# Altium schematic sheet 105358-3SC002-01-A_IR_extra.SchDoc: I/O Board
size 420 x 297 mm; DrawnBy: JeSa , KaKa; Organization: Hotswap Norden AB; Address1: Knarrarnäsgatan 7; Address2: SE-164 40 Kista; Address3: Sweden; DocumentNumber: 105358-3SC001-01; SheetNumber: 5; SheetTotal: 5; PageSetup: Record=PageOptions|CenterHorizontal=True|CenterVertical=True|PrintScale=0.96|XCorrection=1.00|YCorrection=1.00|PrintKind=0|BorderSize=5000000|LeftOffset=0|BottomOffset=0|Orientation=2|PaperLength=1000|PaperWidth=1000|Scale=100|PaperSource=7|PrintQuality=-4|MediaType=1|DitherType=10|PaperKind=A3|PrintScaleMode=1
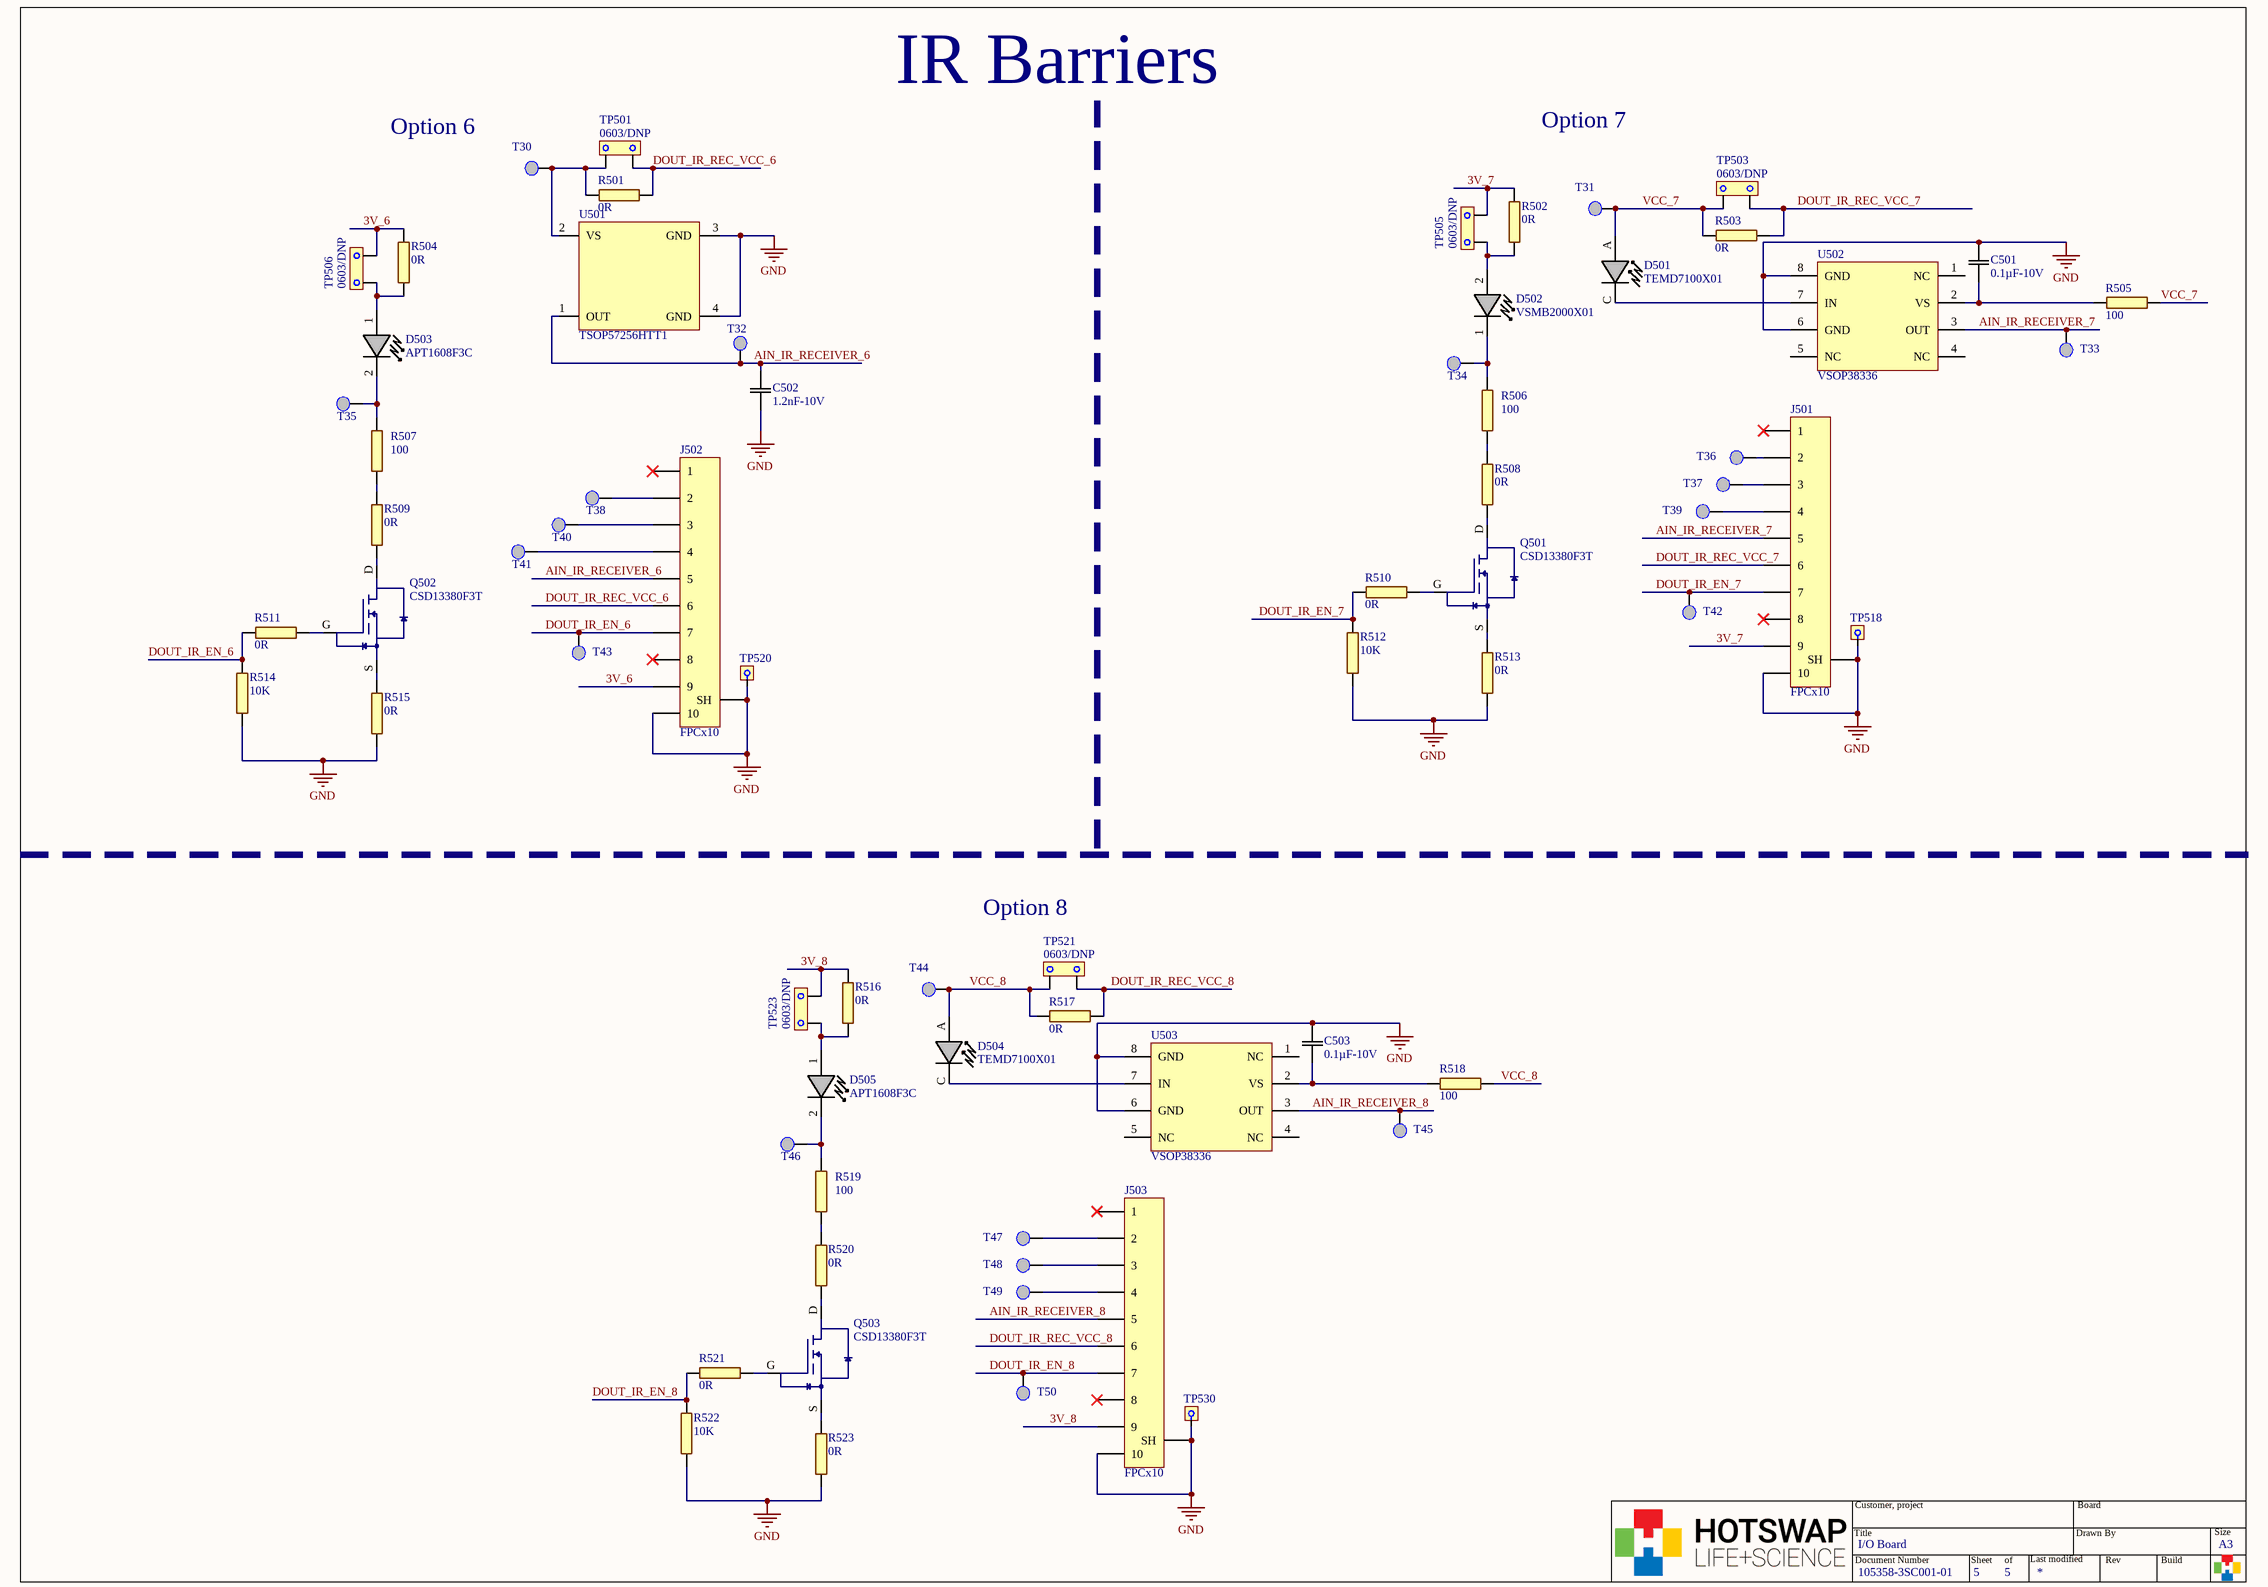
[diagram p0: 105358-3SC002-01-A_IR_extra.SchDoc]

## Parts
C501  0.1µF-10V  [0402C_HIGH_DENSITY]
C502  1.2nF-10V  [0402C_HIGH_DENSITY]
C503  0.1µF-10V  [0402C_HIGH_DENSITY]
D501  TEMD7100X01  [TEMD7100X01]
D502  VSMB2000X01  [SODFL580X160]
D503  APT1608F3C  [APT1608F3C]
D504  TEMD7100X01  [TEMD7100X01]
D505  APT1608F3C  [APT1608F3C]
J501  FPCx10  [FPCx10-5034801000]
J502  FPCx10  [FPCx10-5034801000]
J503  FPCx10  [FPCx10-5034801000]
Q501  CSD13380F3T  [CSD13380F3-DFN40P69X35-3L]
Q502  CSD13380F3T  [CSD13380F3-DFN40P69X35-3L]
Q503  CSD13380F3T  [CSD13380F3-DFN40P69X35-3L]
R501  0R  [0603R-GENRIC]
R502  0R  [0603R-GENRIC]
R503  0R  [0603R-GENRIC]
R504  0R  [0603R-GENRIC]
R505  100  [0402R-GENERIC]
R506  100  [0402R-GENERIC]
R507  100  [0402R-GENERIC]
R508  0R  [0603R-GENRIC]
R509  0R  [0603R-GENRIC]
R510  0R  [0603R-GENRIC]
R511  0R  [0603R-GENRIC]
R512  10K  [0402R-GENERIC]
R513  0R  [0603R-GENRIC]
R514  10K  [0402R-GENERIC]
R515  0R  [0603R-GENRIC]
R516  0R  [0603R-GENRIC]
R517  0R  [0603R-GENRIC]
R518  100  [0402R-GENERIC]
R519  100  [0402R-GENERIC]
R520  0R  [0603R-GENRIC]
R521  0R  [0603R-GENRIC]
R522  10K  [0402R-GENERIC]
R523  0R  [0603R-GENRIC]
T30  TEST POINT  [PAD TEST POINT]  (value not drawn)  (no BOM)
T31  TEST POINT  [PAD TEST POINT]  (value not drawn)  (no BOM)
T32  TEST POINT  [PAD TEST POINT]  (value not drawn)  (no BOM)
T33  TEST POINT  [PAD TEST POINT]  (value not drawn)  (no BOM)
T34  TEST POINT  [PAD TEST POINT]  (value not drawn)  (no BOM)
T35  TEST POINT  [PAD TEST POINT]  (value not drawn)  (no BOM)
T36  TEST POINT  [PAD TEST POINT]  (value not drawn)  (no BOM)
T37  TEST POINT  [PAD TEST POINT]  (value not drawn)  (no BOM)
T38  TEST POINT  [PAD TEST POINT]  (value not drawn)  (no BOM)
T39  TEST POINT  [PAD TEST POINT]  (value not drawn)  (no BOM)
T40  TEST POINT  [PAD TEST POINT]  (value not drawn)  (no BOM)
T41  TEST POINT  [PAD TEST POINT]  (value not drawn)  (no BOM)
T42  TEST POINT  [PAD TEST POINT]  (value not drawn)  (no BOM)
T43  TEST POINT  [PAD TEST POINT]  (value not drawn)  (no BOM)
T44  TEST POINT  [PAD TEST POINT]  (value not drawn)  (no BOM)
T45  TEST POINT  [PAD TEST POINT]  (value not drawn)  (no BOM)
T46  TEST POINT  [PAD TEST POINT]  (value not drawn)  (no BOM)
T47  TEST POINT  [PAD TEST POINT]  (value not drawn)  (no BOM)
T48  TEST POINT  [PAD TEST POINT]  (value not drawn)  (no BOM)
T49  TEST POINT  [PAD TEST POINT]  (value not drawn)  (no BOM)
T50  TEST POINT  [PAD TEST POINT]  (value not drawn)  (no BOM)
TP501  0603/DNP  [TESTPOINT_C_R0608]  (no BOM)
TP503  0603/DNP  [TESTPOINT_C_R0608]  (no BOM)
TP505  0603/DNP  [TESTPOINT_C_R0608]  (no BOM)
TP506  0603/DNP  [TESTPOINT_C_R0608]  (no BOM)
TP518  TP_V_HOOK  [Testpoint_Hook]  (value not drawn)  (no BOM)
TP520  TP_V_HOOK  [Testpoint_Hook]  (value not drawn)  (no BOM)
TP521  0603/DNP  [TESTPOINT_C_R0608]  (no BOM)
TP523  0603/DNP  [TESTPOINT_C_R0608]  (no BOM)
TP530  TP_V_HOOK  [Testpoint_Hook]  (value not drawn)  (no BOM)
U501  TSOP57256HTT1  [TSOP57256HTT1]
U502  VSOP38336  [VSOP38336]
U503  VSOP38336  [VSOP38336]

## Nets
GND: C501.2 C502.1 C503.2 J501.10 J501.SH J502.10 J502.SH J503.10 J503.SH R512.2 R513.1 R514.2 R515.1 R522.2 R523.1 TP518.1 TP520.1 TP530.1 U501.3(GND) U501.4(GND) U502.6(GND) U502.8(GND) U503.6(GND) U503.8(GND)
3V_6: J502.9 R504.2 TP506.2
3V_7: J501.9 R502.2 TP505.2
3V_8: J503.9 R516.2 TP523.2
AIN_IR_RECEIVER_6: C502.2 J502.5 T32.1(Test_Point) U501.1(OUT)
AIN_IR_RECEIVER_7: J501.5 T33.1(Test_Point) U502.3(OUT)
AIN_IR_RECEIVER_8: J503.5 T45.1(Test_Point) U503.3(OUT)
DOUT_IR_EN_6: J502.7 R511.1 R514.1 T43.1(Test_Point)
DOUT_IR_EN_7: J501.7 R510.1 R512.1 T42.1(Test_Point)
DOUT_IR_EN_8: J503.7 R521.1 R522.1 T50.1(Test_Point)
DOUT_IR_REC_VCC_6: J502.6 R501.2 TP501.2
DOUT_IR_REC_VCC_7: J501.6 R503.2 TP503.2
DOUT_IR_REC_VCC_8: J503.6 R517.2 TP521.2
VCC_7: D501.A R503.1 R505.2 T31.1(Test_Point) TP503.1
VCC_8: D504.A R517.1 R518.2 T44.1(Test_Point) TP521.1
NetC501_1: C501.1 R505.1 U502.2(VS)
NetC503_1: C503.1 R518.1 U503.2(VS)
NetD501_C: D501.C U502.7(IN)
NetD502_1: D502.1(C) R506.1 T34.1(Test_Point)
NetD502_2: D502.2(A) R502.1 TP505.1
NetD503_1: D503.1(A) R504.1 TP506.1
NetD503_2: D503.2(K) R507.1 T35.1(Test_Point)
NetD504_C: D504.C U503.7(IN)
NetD505_1: D505.1(A) R516.1 TP523.1
NetD505_2: D505.2(K) R519.1 T46.1(Test_Point)
NetJ501_2: J501.2 T36.1(Test_Point)
NetJ501_3: J501.3 T37.1(Test_Point)
NetJ501_4: J501.4 T39.1(Test_Point)
NetJ502_2: J502.2 T38.1(Test_Point)
NetJ502_3: J502.3 T40.1(Test_Point)
NetJ502_4: J502.4 T41.1(Test_Point)
NetJ503_2: J503.2 T47.1(Test_Point)
NetJ503_3: J503.3 T48.1(Test_Point)
NetJ503_4: J503.4 T49.1(Test_Point)
NetQ501_D: Q501.D R508.2
NetQ501_G: Q501.G R510.2
NetQ501_S: Q501.S R513.2
NetQ502_D: Q502.D R509.2
NetQ502_G: Q502.G R511.2
NetQ502_S: Q502.S R515.2
NetQ503_D: Q503.D R520.2
NetQ503_G: Q503.G R521.2
NetQ503_S: Q503.S R523.2
NetR501_1: R501.1 T30.1(Test_Point) TP501.1 U501.2(VS)
NetR506_2: R506.2 R508.1
NetR507_2: R507.2 R509.1
NetR519_2: R519.2 R520.1

Not connected (* = marked no-connect by the designer): J501 1* 8*; J502 1* 8*; J503 1* 8*; U502 1(NC) 4(NC) 5(NC); U503 1(NC) 4(NC) 5(NC)

## Notes on the sheet
- IR Barriers
- Option 7
- Option 6
- Option 8
- Title
- Customer, project
- Drawn By
- Board
- Size
- Document Number
- Sheet
- of
- Last modified
- Rev
- Build
- A3

## Library data of the parts
C501 C503 = 0402C-0.1uF-10V: 0.1µF ±10% 10V X5R Ceramic Capacitor 0402; Manufacturer Part Number: CC0402KRX5R6BB104; Manufacturer: Yageo; Capacitance: 0.1µF; Digi-Key Part Number: 311-1336-1-ND; PackageReference: 0402; Temperature Coefficient: X5R; Tolerance: 10%; Voltage - Rated: 10V
C502 = 0402C-1.2nF-10V: 1.2nF ±10% 10V U2J Ceramic Capacitor 0402; Manufacturer Part Number: GRM1557U1A122JA01D; Manufacturer: Murata Electronics North America; Tolerance: 5%; Capacitance: 1.2nF; Digi-Key Part Number: 490-6272-1-ND; PackageReference: 0402; Temperature Coefficient: U2J; Voltage - Rated: 10V
D501 D504 = TEMD7100X01: PHOTODIODE PIN 950NM 0805; Manufacturer: Vishay Semiconductor Opto Division; Type: Infrared (IR); Current - Dark (Typ): 1nA; Response Time: 100ns; Voltage - DC Reverse (Vr) (Max): 60V; Viewing Angle: 120°; Supplier 1: Digi-Key; Supplier Part Number 1: 754-1433-1-ND; Manufacturer Part Number: TEMD7100X01; PackageReference: 0805; Wavelength: 950nm; Mounting Type: Surface Mount; Operating Temperature: -40°C ~ 100°C; ComponentLink1Description: Datasheet; ComponentLink1URL: http://www.vishay.com/docs/81960/temd7100.pdf; Digi-Key Part Number: TEMD7100X01CT-ND
D502 = VSMB2000X01: EMITTER IR 940NM 100MA SMD; Manufacturer: Vishay Semiconductor Opto Division; Type: Infrared (IR); Radiant Intensity (Ie) Min @ If: 20mW/sr @ 100mA; Voltage - Forward (Vf) (Typ): 1.35V; Viewing Angle: 24°; Manufacturer Part Number: VSMB2000X01; PackageReference: 2-SMD, Z-Bend; Wavelength: 940nm; Current - DC Forward (If) (Max): 100mA; Mounting Type: Surface Mount; Operating Temperature: -40°C ~ 85°C (TA); ComponentLink1Description: Datasheet; ComponentLink1URL: http://www.vishay.com/docs/81930/vsmb2000.pdf; Digi-Key Part Number: VSMB2000X01CT-ND
D503 D505 = APT1608F3C: 0603 INFRARED DIODE; Manufacturer: Kingbright; Wavelength: 940nm; Type: Infrared (IR); Current - DC Forward (If) (Max): 50mA; Radiant Intensity (Ie) Min @ If: 1.2mW/sr @ 20mA; Voltage - Forward (Vf) (Typ): 1.2V; Viewing Angle: 120°; Manufacturer Part Number: APT1608F3C; PackageReference: 0603; Mounting Type: Surface Mount; Operating Temperature: -40°C ~ 85°C (TA); ComponentLink1Description: Datasheet; ComponentLink1URL: http://www.kingbrightusa.com/images/catalog/SPEC/APT1608F3C.pdf; Digi-Key Part Number: 754-1433-1-ND; Supplier 1: Digi-Key; Supplier Part Number 1: 754-1433-1-ND; ClassName: 3D_EXPORT
J501-J503 = FPCx10: CONN FFC FPC 10POS 0.50MM R/A; Manufacturer Part Number: 5034801000; Manufacturer: Molex, LLC; ComponentLink1URL: http://www.molex.com/pdm_docs/sd/5034801000_sd.pdf; ComponentLink1Description: Datasheet; Mounting Type: SMD; Digi-Key Part Number: WM1389CT-ND
Q501-Q503 = CSD13380F3T: 12V N-CHANNEL FEMTOFET MOSFET; Manufacturer: Texas Instruments; Digi-Key Part Number: CSD13380F3T; Manufacturer Part Number: CSD13380F3T; FET Type: N-Channel; Package / Case: 3-XFDFN; ComponentLink1Description: Datasheet; ComponentLink1URL: http://www.ti.com/lit/ds/symlink/csd13380f3.pdf
R501-R504 R508-R511 R513 R515-R517 R520 R521 R523 = 0603R-0R -1%-0.063W: RES SMD 0 OHM 1% 1/10W 0603; Power: 0.063W; GENERIC_OK: YES; Resistance (Ohms): 0R; PackageReference: 0603
R505-R507 R518 R519 = 0402R-100 OHM-1%-0.063W: RES SMD 100OHM 1% 1/16W 0402; Manufacturer: Yageo; Manufacturer Part Number: RC0402FR-07100RL; Power: 0.063W; GENERIC_OK: YES; Digi-Key Part Number: 311-100LRCT-ND; Resistance (Ohms): 100Ohm; Tolerance: 1%; PackageReference: 0402; Features: Moisture Resistant
R512 R514 R522 = 0402R-10k OHM-1%-0.063W: RES SMD 10kOHM 1% 1/16W 0402; Manufacturer: Yageo; Manufacturer Part Number: RC0402FR-0710KL; Power: 0.063W; GENERIC_OK: YES; Digi-Key Part Number: 311-10.0KLRCT-ND; Resistance (Ohms): 10KOhm; Tolerance: 1%; PackageReference: 0402; Features: Moisture Resistant
T30-T50 = TEST POINT: Testing Poiny
TP501 TP503 TP505 TP506 TP521 TP523 = TP_C_R0603: Test point for Med Current 0402 JUMPER SMD O OHM 1% 1/4W 0603; ClassName: TP
TP518 TP520 TP530 = TP_V_HOOK: Black PC Test Point; Manufacturer: Keystone Electronics; Manufacturer Part Number: 5001; Digi-Key Part Number: 36-5001-ND
U501 = TSOP57256HTT1: MOD IR RCVR 56KHZ TOP VIEW SHIEL; Manufacturer: Vishay Semiconductor Opto Division; Voltage Supply: 2.5V ~ 5.5V; Current Supply: 700µA; B.P.F. Center Frequency: 56.0kHz; Sensing Distance: 40m; ComponentLink1URL: http://www.vishay.com/docs/82434/tsop572.pdf; ComponentLink1Description: Datasheet; Manufacturer Part Number: TSOP57256HTT1; Digi-Key Part Number: TSOP57256HTT1-ND
U502 U503 = VSOP38336: IC SIGNAL CONDITIONING 36KHZ QFN; Manufacturer: Vishay Semiconductor Opto Division; Voltage - Supply: 2.5V ~ 5.5V; Current - Supply: 350µA; ComponentLink1URL: http://www.vishay.com/docs/82443/vsop383.pdf; ComponentLink1Description: Datasheet; Manufacturer Part Number: VSOP38336; PackageReference: 8-XFBGA, DSBGA; Digi-Key Part Number: VSOP38336CT-ND; B.P.F. Center Frequency: 36KHz